# EAGLE design SPIdisplay-8x7seg (EAGLE 7.2.0)
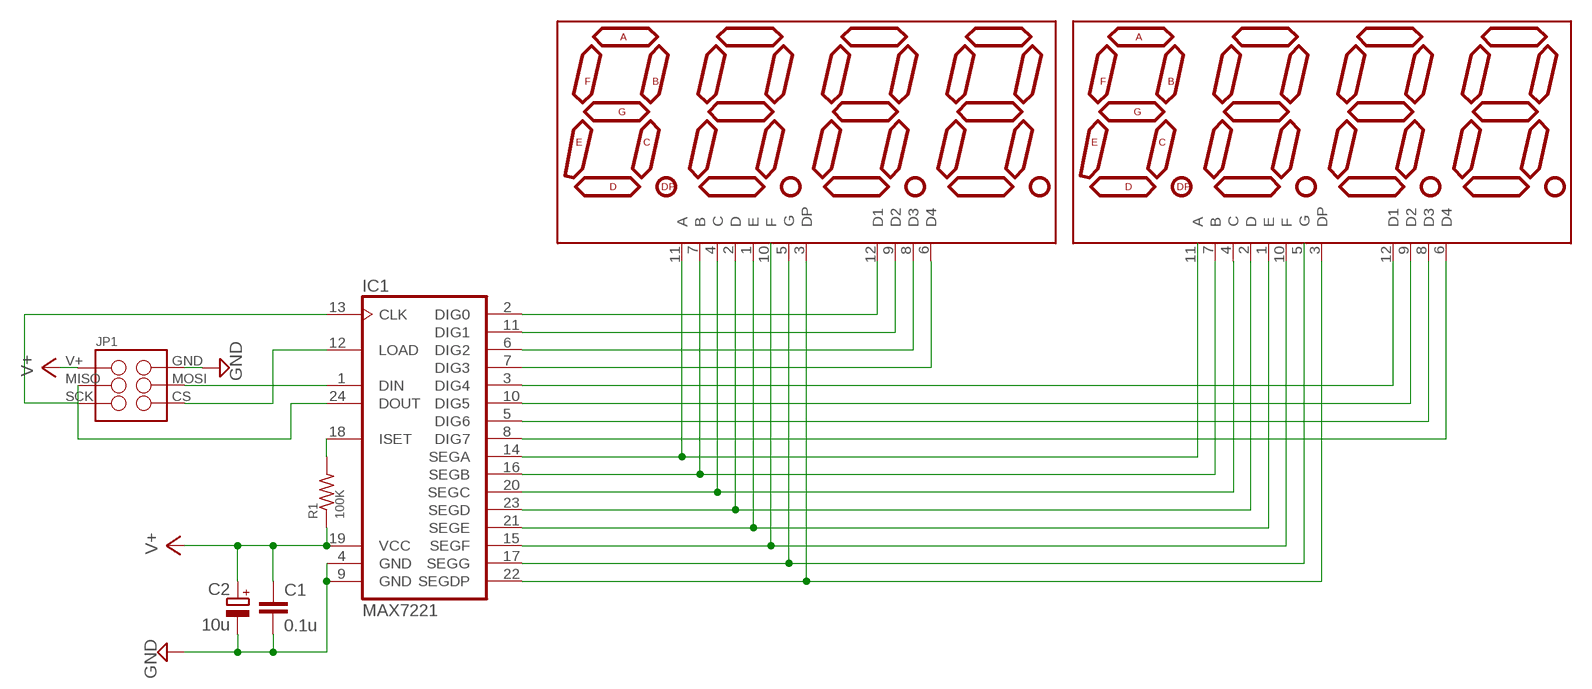
[diagram p0: schematic, sheet 1]

## Parts
C1  0.1u  C-EU050-025X075  [C050-025X075]
C2  10u  CPOL-EUE2.5-5  [E2,5-5]
DISP1  7-SEG-4DIG-LD-3461AS-HP-BUBBLE  [DIL12]
DISP2  7-SEG-4DIG-LD-3461AS-HP-BUBBLE  [DIL12]
IC1  MAX7221  [DIL24-3]
JP1  M03X2SHROUD  [2X3-SPI-SHROUDED]
R1  100K  R-US_0207/10  [0207/10]

## Nets
GND: C1.2 C2.- IC1.4(GND) IC1.9(GND) JP1.2
N$1: IC1.1(DIN) JP1.4
N$2: IC1.12(LOAD) JP1.6
N$3: IC1.13(CLK) JP1.5
N$4: IC1.24(DOUT) JP1.3
N$5: IC1.18(ISET) R1.2
N$6: DISP1.12(D1) IC1.2(DIG0)
N$7: DISP1.9(D2) IC1.11(DIG1)
N$8: DISP1.8(D3) IC1.6(DIG2)
N$9: DISP1.6(D4) IC1.7(DIG3)
N$10: DISP2.12(D1) IC1.3(DIG4)
N$11: DISP2.9(D2) IC1.10(DIG5)
N$12: DISP2.8(D3) IC1.5(DIG6)
N$13: DISP2.6(D4) IC1.8(DIG7)
N$14: DISP1.11(A) IC1.14(SEGA)
N$15: DISP1.7(B) DISP2.7(B) IC1.16(SEGB)
N$16: DISP1.4(C) DISP2.4(C) IC1.20(SEGC)
N$17: DISP1.2(D) DISP2.2(D) IC1.23(SEGD)
N$18: DISP1.1(E) DISP2.1(E) IC1.21(SEGE)
N$19: DISP2.10(F) IC1.15(SEGF)
N$20: DISP1.5(G) IC1.17(SEGG)
N$21: DISP1.3(DP) DISP2.3(DP) IC1.22(SEGDP)
V+: C1.1 C2.+ IC1.19(VCC) JP1.1 R1.1
Unconnected: DISP1.10(F) DISP2.5(G) DISP2.11(A)

## Library data of the parts
C1 = resistor:C-EU: CAPACITOR, European symbol
C2 = resistor:CPOL-EU: POLARIZED CAPACITOR, European symbol
DISP1 DISP2 = SparkFun-Displays:7-SEG-4DIG-LD-3461AS; STOREFRONT: COM-12710
IC1 = CustomParts:MAX7221: LED DISPLAY DRIVER; MF: MAXIM; MPN: MAX7221
JP1 = CustomParts:M03X2: 2x3 .1" header. Shrouded, with keying- CONN-10681 SMT- CONN-11415 Pogo pins- HW-11044; PROD_ID: CONN-10681
R1 = resistor:R-US_: RESISTOR, American symbol

## Board
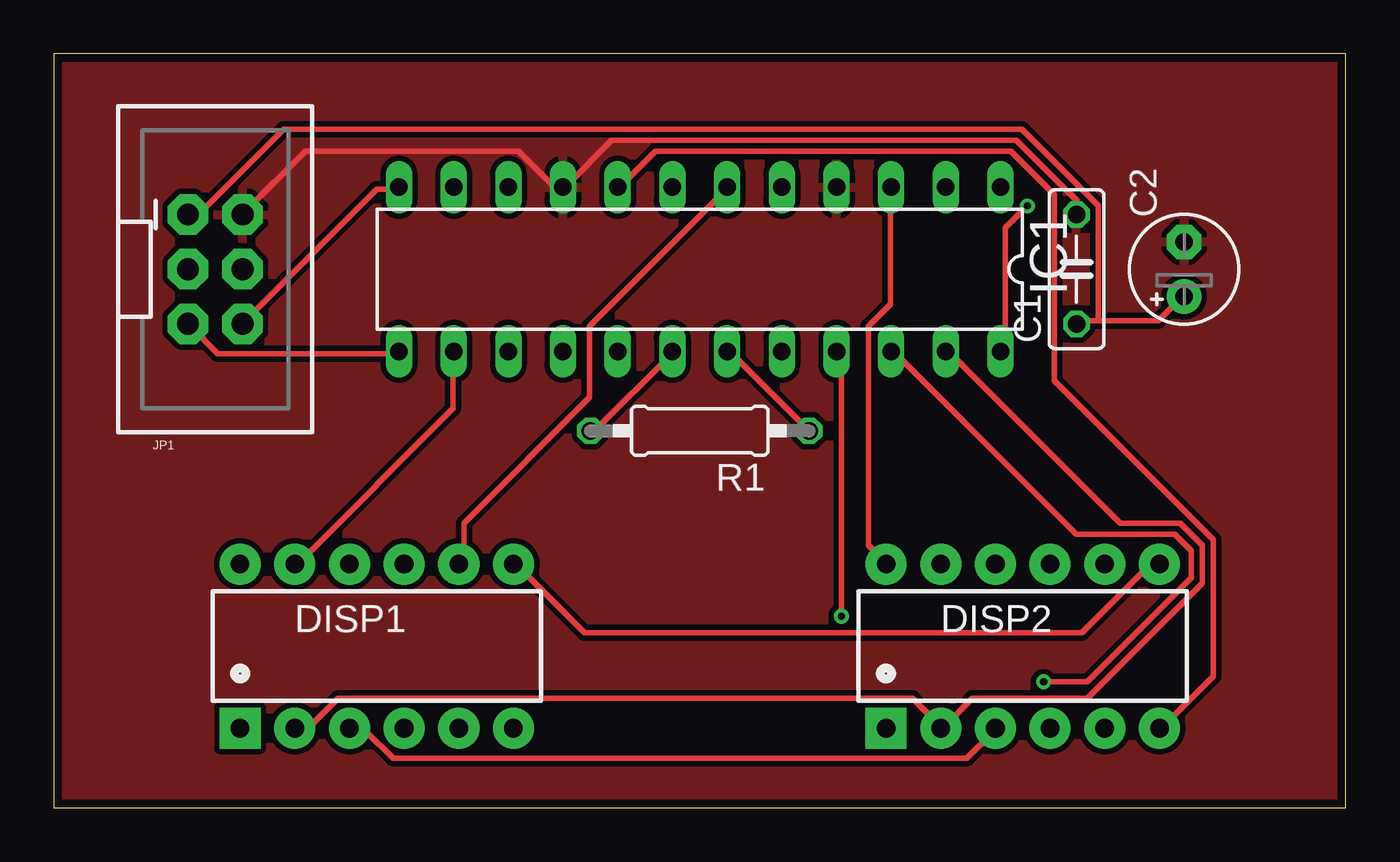
[diagram p1: board, top side]
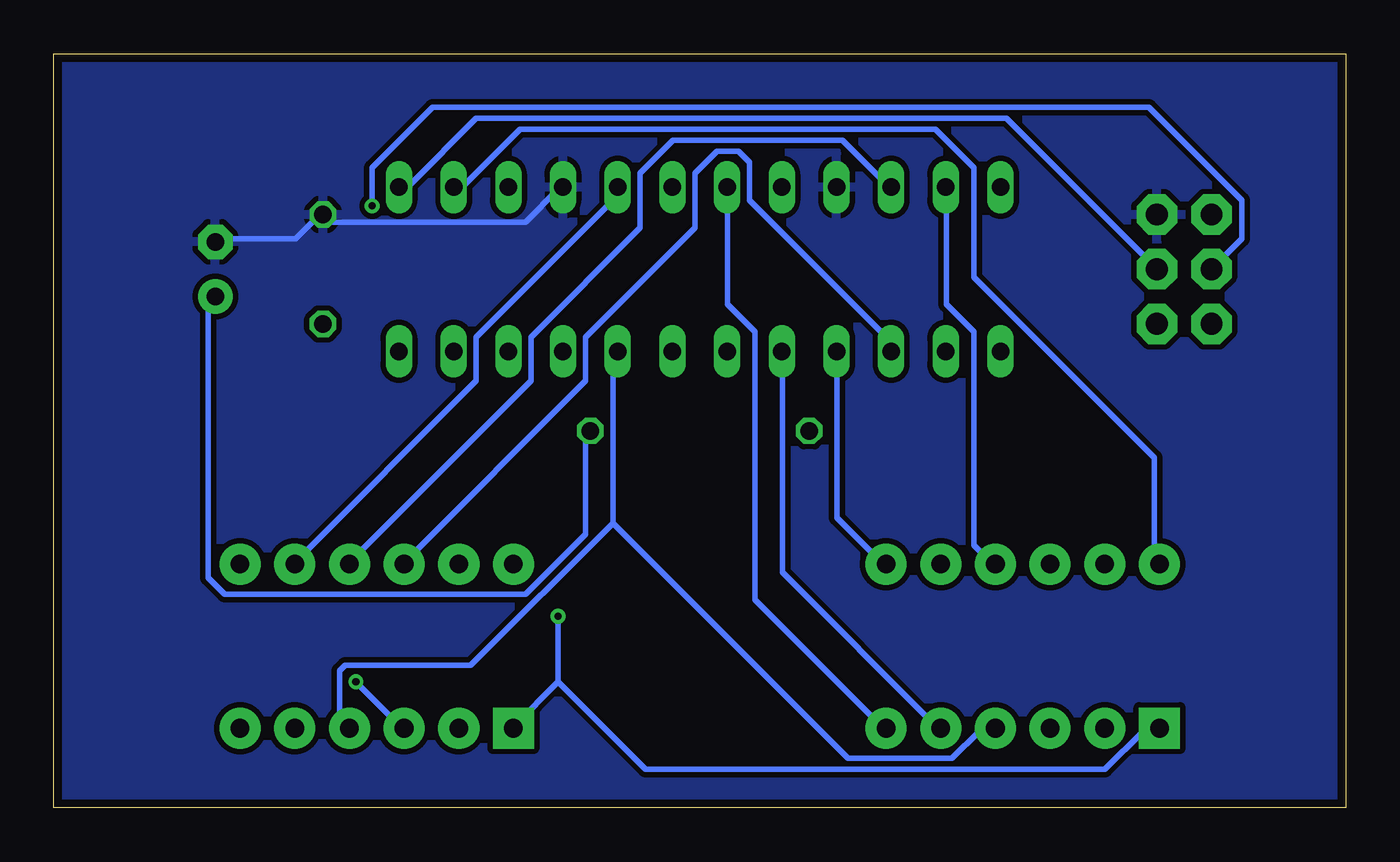
[diagram p2: board, bottom side, seen from below]

Size 60 x 35 mm. Coordinates in mm from the lower left corner, seen from the top.
Outline: 0,0 60,0 60,35 0,35 0,0
Copper layers (1*16): Top 0.0356mm / dielectric 1.5011mm / Bottom 0.0356mm
Design rules "LaenPCBOrder *": minimum track width 10mil, minimum drill 13mil, track to track 10mil, track to pad 10mil, pad to pad 10mil, via to via 10mil, smd to smd 10mil, copper to edge 15mil, drill to drill 6mil, minimum pad ring 7mil, minimum via ring 7mil, stop-mask expansion 3mil, vias tented up to drill 0mil, thermal gap 10mil

### Footprints (pad centres in the part's own frame; a part is rotated, then mirrored left to right if it is on the bottom)
C050-025X075 = drill 0.813 octagon: 1 -2.54,0; 2 2.54,0
E2,5-5 = drill 0.813 pad 1.6: + -1.27,0 | drill 0.813 pad 1.6 octagon: - 1.27,0
DIL12 = drill 0.864 pad 1.905 square: 1 -6.35,-3.81 | drill 0.864 pad 1.905: 2 -3.81,-3.81; 3 -1.27,-3.81; 4 1.27,-3.81; 5 3.81,-3.81; 6 6.35,-3.81; 7 6.35,3.81; 8 3.81,3.81; 9 1.27,3.81; 10 -1.27,3.81; 11 -3.81,3.81; 12 -6.35,3.81
DIL24-3 = drill 0.813 long: 1 -13.97,-3.81; 2 -11.43,-3.81; 3 -8.89,-3.81; 4 -6.35,-3.81; 5 -3.81,-3.81; 6 -1.27,-3.81; 7 1.27,-3.81; 8 3.81,-3.81; 9 6.35,-3.81; 10 8.89,-3.81; 11 11.43,-3.81; 12 13.97,-3.81; 13 13.97,3.81; 14 11.43,3.81; 15 8.89,3.81; 16 6.35,3.81; 17 3.81,3.81; 18 1.27,3.81; 19 -1.27,3.81; 20 -3.81,3.81; 21 -6.35,3.81; 22 -8.89,3.81; 23 -11.43,3.81; 24 -13.97,3.81
2X3-SPI-SHROUDED = drill 1.016 pad 1.88 octagon: 1 -1.27,2.54; 2 1.27,2.54; 3 -1.27,0; 4 1.27,0; 5 -1.27,-2.54; 6 1.27,-2.54
0207/10 = drill 0.813 octagon: 1 -5.08,0; 2 5.08,0

### Placement (x,y rotation side)
C1  47.5,25 90 top
C2  52.5,25 90 top
DISP1  15,7.5 0 top
DISP2  45,7.5 0 top
IC1  30,25 180 top
JP1  7.5,25 0 top
R1  30,17.5 180 top

### Tracks (layer width: path | path; a pad name or v marks a point on that pad's centre or on a via)
GND
  Top 0.254: JP1.2 8.89,27.69 11.68,30.48 21.59,30.48 23.11,28.96 23.62,28.96 IC1.9 23.88,28.96 25.91,30.99 44.7,30.99 47.5,28.19 47.5,27.69 C1.2
  Bottom 0.254: IC1.4 36.58,28.7 38.1,27.18 47.24,27.18 47.5,27.43 C1.2 47.75,27.43 48.77,26.42 52.32,26.42 C2.-
  pour Bottom: 0,0 0,35 60,35 60,0 27.5,0
  pour Top: 0,0 0,35 60,35 60,0 2.5,0
N$1
  Bottom 0.254: IC1.1 43.94,28.96 43.43,28.96 40.39,32 15.75,32 8.89,25.15 JP1.4
N$2
  Top 0.254: IC1.12 16,28.7 14.99,28.7 8.89,22.61 JP1.6
N$3
  Top 0.254: IC1.13 16,21.08 7.62,21.08 6.35,22.35 JP1.5
N$4  (via drill 0.33)
  Top 0.254: v45.21,27.94 44.2,26.92 44.2,21.34 IC1.24
  Bottom 0.254: v45.21,27.94 45.21,29.72 42.42,32.51 9.14,32.51 4.83,28.19 4.83,26.42 6.1,25.15 JP1.3
N$5
  Top 0.254: R1.2 25.15,17.53 28.7,21.08 IC1.18
N$6
  Bottom 0.254: IC1.2 41.4,28.96 40.89,28.96 38.35,31.5 19.05,31.5 17.27,29.72 17.27,24.64 8.89,16.26 8.89,11.43 DISP1.12
N$7
  Bottom 0.254: IC1.11 18.54,28.7 18.54,23.37 17.27,22.1 17.27,12.19 16.51,11.43 DISP1.9
N$8
  Top 0.254: IC1.6 31.24,28.7 24.89,22.35 24.89,19.05 19.05,13.21 19.05,11.43 DISP1.8
N$9
  Bottom 0.254: IC1.7 28.7,28.7 28.7,23.37 27.43,22.1 27.43,9.65 21.59,3.81 DISP1.6
N$10
  Top 0.254: IC1.3 38.86,28.7 38.86,23.37 37.85,22.35 37.85,12.19 38.61,11.43 DISP2.12
N$11
  Bottom 0.254: IC1.10 21.34,28.96 23.37,30.99 31.24,30.99 32.77,29.46 32.77,26.92 37.85,21.84 37.85,19.81 46.23,11.43 DISP2.9
N$12
  Bottom 0.254: IC1.5 34.04,28.7 34.04,28.19 40.39,21.84 40.39,19.81 48.77,11.43 DISP2.8
N$13
  Top 0.254: IC1.8 26.42,28.96 27.94,30.48 44.45,30.48 46.48,28.45 46.48,19.81 53.85,12.45 53.85,6.1 51.56,3.81 DISP2.6
N$14
  Top 0.254: IC1.14 18.54,21.08 18.54,18.54 11.43,11.43 DISP1.11
N$15
  Top 0.254: DISP2.7 51.31,11.18 50.8,11.18 47.75,8.13 24.64,8.13 21.59,11.18 DISP1.7
  Bottom 0.254: IC1.16 23.62,21.08 23.62,13.46 21.59,11.43 DISP1.7
N$16
  Bottom 0.254: 34.04,13.21 34.04,21.08 IC1.20 | 34.04,13.21 40.64,6.6 46.48,6.6 46.74,6.35 46.74,4.06 46.48,3.81 DISP2.4 | 34.04,13.21 23.11,2.29 18.29,2.29 17.02,3.56 16.51,3.56 DISP1.4
N$17
  Top 0.254: IC1.23 41.66,21.08 49.53,13.21 52.32,13.21 53.34,12.19 53.34,10.41 48.01,5.08 42.67,5.08 41.4,3.81 DISP2.2 41.15,3.81 39.88,5.08 13.21,5.08 11.94,3.81 11.43,3.81 DISP1.2
N$18  (via drill 0.33)
  Top 0.254: v36.58,8.89 36.58,21.08 IC1.21
  Bottom 0.254: 36.58,5.84 v36.58,8.89 | 36.58,5.84 38.61,3.81 DISP2.1 | 36.58,5.84 32.51,1.78 11.18,1.78 9.4,3.56 8.89,3.56 DISP1.1
N$19
  Bottom 0.254: IC1.15 21.34,21.34 21.34,21.84 27.69,28.19 27.69,29.97 28.19,30.48 29.21,30.48 30.23,29.46 30.23,26.92 35.31,21.84 35.31,19.81 43.69,11.43 DISP2.10
N$20
  Bottom 0.254: IC1.17 26.16,21.08 26.16,10.92 19.05,3.81 DISP1.5
N$21  (via drill 0.33)
  Top 0.254: v45.97,5.84 48.01,5.84 52.83,10.67 52.83,11.94 52.07,12.7 47.5,12.7 39.12,21.08 IC1.22 | DISP1.3 13.97,3.56 14.48,3.56 15.75,2.29 42.42,2.29 43.69,3.56 DISP2.3
  Bottom 0.254: v45.97,5.84 43.94,3.81 DISP2.3
V+
  Top 0.254: R1.1 35.05,17.53 31.5,21.08 IC1.19 | 48.51,22.61 51.31,22.61 52.32,23.62 C2.+ | 48.51,22.61 47.75,22.61 C1.1 | 48.51,22.61 48.51,27.94 44.96,31.5 10.67,31.5 6.86,27.69 6.35,27.69 JP1.1
  Bottom 0.254: R1.1 35.31,17.27 35.31,12.7 38.1,9.91 52.07,9.91 52.83,10.67 52.83,23.37 52.58,23.62 C2.+